# Altium schematic sheet Sheet3.SchDoc
size A
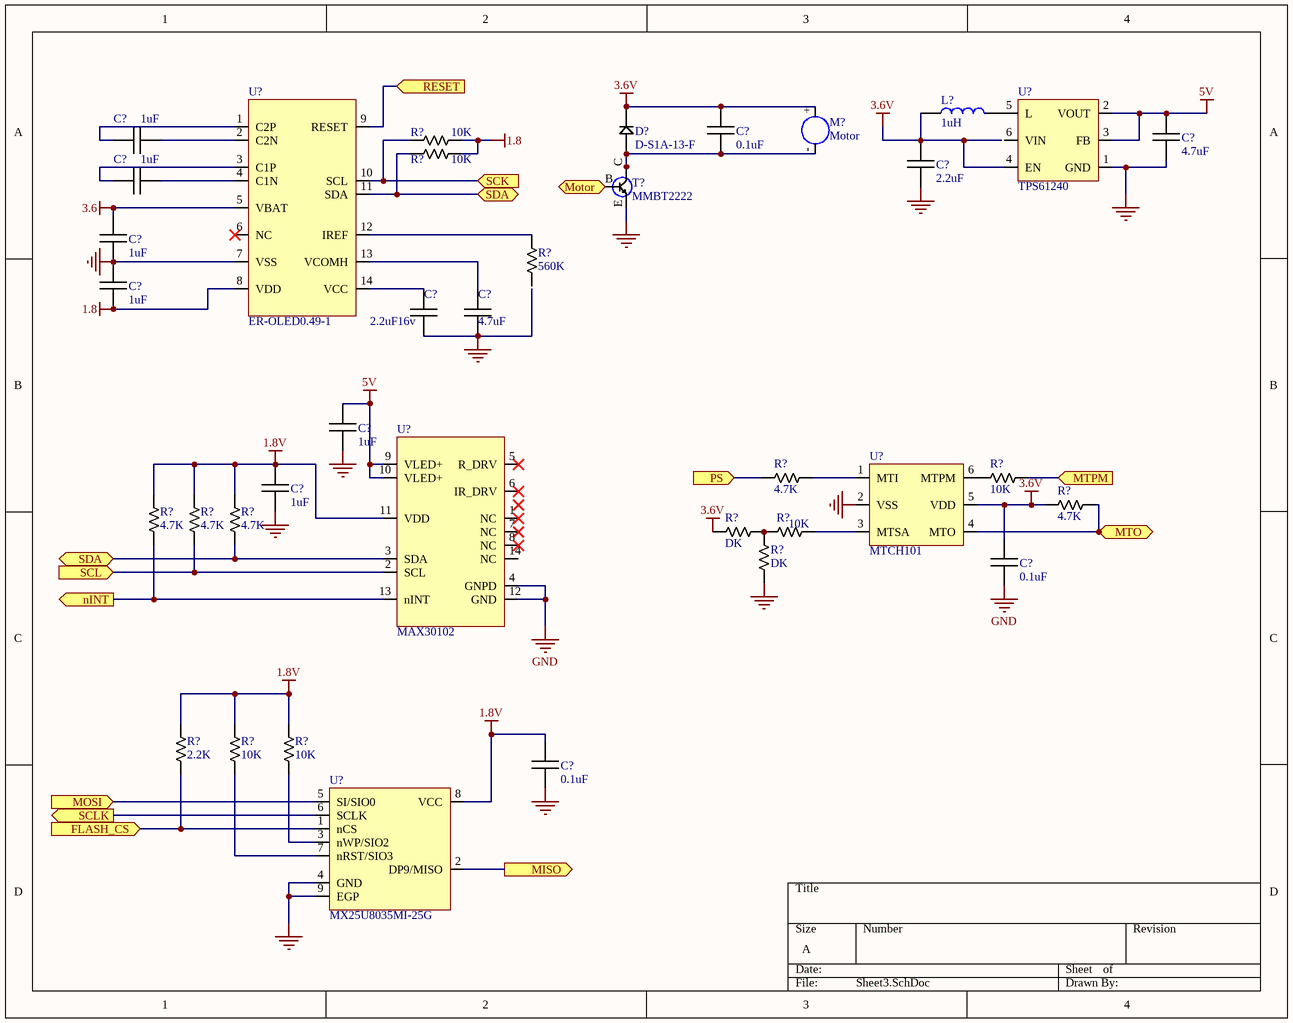
[diagram p0: Sheet3.SchDoc]

## Parts
(Parts that share a designator on the sheet are numbered #1, #2 ... from top to bottom, then left to right.)
C?#1  0.1uF
C?#2  4.7uF
C?#3  1uF
C?#4  2.2uF
C?#5  1uF
C?#6  1uF
C?#7  1uF
C?#8  2.2uF16v
C?#9  4.7uF
C?#10  1uF
C?#11  1uF
C?#12  0.1uF
C?#13  0.1uF
D?  D-S1A-13-F
L?  1uH
M?  Motor
R?#1  10K  [R0603]
R?#2  10K  [R0603]
R?#3  560K  [R0603]
R?#4  4.7K  [R0603]
R?#5  10K  [R0603]
R?#6  4.7K  [R0603]
R?#7  4.7K  [R0603]
R?#8  4.7K  [R0603]
R?#9  4.7K  [R0603]
R?#10  DK  [R0603]
R?#11  10K  [R0603]
R?#12  DK  [R0603]
R?#13  2.2K
R?#14  10K  [R0603]
R?#15  10K  [R0603]
T?  MMBT2222
U?#1  TPS61240
U?#2  ER-OLED0.49-1
U?#3  MTCH101
U?#4  MAX30102
U?#5  MX25U8035MI-25G

## Ports
FLASH_CS (in), MISO (out), MOSI (in), Motor (in), MTO (out), MTPM (in), nINT (out), PS (in), RESET (in), SCK (in), SCL (in), SCLK (out), SDA (bidir)

## Nets
1.8: C?#7.2 R?#1.1 R?#2.1 U?#2.8(VDD)
1.8V: C?#11.2 C?#13.2 R?#7.2 R?#8.2 R?#9.2 R?#13.2 R?#14.2 R?#15.2 U?#4.11(VDD) U?#5.8(VCC)
3.6: C?#6.2 U?#2.5(VBAT)
3.6V: C?#1.2 C?#4.2 C?#12.2 D?.1(-) L?.1 M?.+ R?#6.2 R?#10.1 U?#1.4(EN) U?#3.5(VDD)
5V: C?#2.2 C?#10.2 U?#1.2(VOUT) U?#1.3(FB) U?#4.9(VLED+) U?#4.10(VLED+)
GND: C?#2.1 C?#4.1 C?#6.1 C?#7.1 C?#8.1 C?#9.1 C?#10.1 C?#11.1 C?#12.1 C?#13.1 R?#12.1 T?.E U?#1.1(GND) U?#2.7(VSS) U?#3.2(VSS) U?#4.4(GNPD) U?#4.12(GND) U?#5.4(GND) U?#5.9(EGP)
FLASH_CS: R?#13.1 U?#5.1(nCS) ; port FLASH_CS
MISO: U?#5.2(DP9/MISO) ; port MISO
MOSI: U?#5.5(SI/SIO0) ; port MOSI
Motor: T?.B ; port Motor
MTO: R?#6.1 U?#3.4(MTO) ; port MTO
MTPM: R?#5.2 ; port MTPM
nINT: R?#7.1 U?#4.13(nINT) ; port nINT
PS: R?#4.1 ; port PS
RESET: U?#2.9(RESET) ; port RESET
SCK: R?#1.2 U?#2.10(SCL) ; port SCK
SCL: R?#8.1 U?#4.2(SCL) ; port SCL
SCLK: U?#5.6(SCLK) ; port SCLK
SDA: R?#2.2 R?#9.1 U?#2.11(SDA) U?#4.3(SDA) ; port SDA
NetC?#1_1: C?#1.1 D?.2(+) M?.- T?.C
NetC?#3_1: C?#3.1 U?#2.2(C2N)
NetC?#3_2: C?#3.2 U?#2.1(C2P)
NetC?#5_1: C?#5.1 U?#2.4(C1N)
NetC?#5_2: C?#5.2 U?#2.3(C1P)
NetC?#8_2: C?#8.2 U?#2.14(VCC)
NetC?#9_2: C?#9.2 U?#2.13(VCOMH)
NetL?_2: L?.2 U?#1.5(L)
NetR?#3_2: R?#3.2 U?#2.12(IREF)
NetR?#4_2: R?#4.2 U?#3.1(MTI)
NetR?#5_1: R?#5.1 U?#3.6(MTPM)
NetR?#10_2: R?#10.2 R?#11.1 R?#12.2
NetR?#11_2: R?#11.2 U?#3.3(MTSA)
NetR?#14_1: R?#14.1 U?#5.7(nRST/SIO3)
NetR?#15_1: R?#15.1 U?#5.3(nWP/SIO2)

Not connected (* = marked no-connect by the designer): R?#3 1; U?#1 6(VIN); U?#2 6(NC)*; U?#4 1(NC)* 5(R_DRV)* 6(IR_DRV)* 7(NC)* 8(NC)* 14(NC)

## Library data of the parts
C?#1 C?#12 C?#13 = C0.1uF_0402: SMD_CAPACITOR; Voltage - Rated: 6.3V; Tolerance: ±10%; Packet: 0402; Digi-Key Part Number: 490-6319-1-ND; Capacitance: 0.1uF
C?#2 = C4.7uF_0402: SMD_CAPACITOR; Voltage - Rated: 6.3V; Tolerance: ±20%; Packet: 0402; Digi-Key Part Number: 587-2787-1-ND; Capacitance: 4.7uF
C?#3 C?#5-C?#7 C?#10 C?#11 = C1uF_0402: SMD_CAPACITOR; Voltage - Rated: 10V; Tolerance: ±10%; Packet: 0402; Digi-Key Part Number: 490-3890-1-ND; Capacitance: 1uF
C?#4 = C2.2uF_0402: SMD_CAPACITOR; Voltage - Rated: 6.3V; Tolerance: ±20%; Packet: 0402; Digi-Key Part Number: 587-1453-1-ND; Capacitance: 2.2uF
C?#8 = C2.2uF_0805: SMD_CAPACITOR; Voltage - Rated: 16V; Tolerance: ±10%; Packet: 0805; Digi-Key Part Number: 490-3906-1-ND; Capacitance: 2.2uF16v
C?#9 = C4.7uF_0805: SMD_CAPACITOR; Voltage - Rated: 16V; Tolerance: ±10%; Packet: 0805; Digi-Key Part Number: 445-1385-1-ND; Capacitance: 4.7uF
D? = D-S1A-13-F: ="Description"; Description: DIODE GEN PURP 50V 1A SMA; Package: DO-214AC, SMA
L? = L1uH_0603: SMD_Inductor; Digi-Key Part Number: 490-15634-1-ND; Inductance: 1uH; Package: 0603
M? = Motor: vibrator coin 7mm; Digi-Key Part Number: 1670-1000-ND
R?#1 R?#2 R?#5 R?#11 R?#14 R?#15 = R10K_0201: SMD_RESISTOR; Packet: 0201; Tolerance: ±5%; Power: 1/20W; Digi-Key Part Number: 311-10KNCT-ND; Value: 10K
R?#3 = R560K_0402: SMD_RESISTOR; Packet: 0402; Tolerance: ±5%; Power: 1/16W; Digi-Key Part Number: 311-560KJRCT-ND; Value: 560K
R?#4 R?#6-R?#9 = R4.7K_0402: SMD_RESISTOR; Packet: 0402; Tolerance: ±1%; Power: 1/16W; Digi-Key Part Number: 311-4.7KLRCT-ND; Value: 4.7K
R?#10 R?#12 = RDK_0402: SMD_RESISTOR; Packet: 0402; Value: DK
R?#13 = R2.2K_0402: SMD_RESISTOR; Packet: 0402; Tolerance: ±1%; Power: 1/16W; Digi-Key Part Number: 311-2.20KLRCT-ND; Value: 2.2K
T? = MMBT2222: SMD_Transistor; Digi-Key Part Number: MMBT2222ALT1GOSCT-ND
U?#1 = TPS61240: IC REG BOOST 5V 0.5A SYNC 6SON; Digi-Key Part Number: 296-39437-1-ND
U?#2 = ER-OLED0.49-1: OLED0.49; Website: http://www.buydisplay.com/default/low-power-smallest-blue-i2c-0-49-inch-64x32-oled-module-display-ssd1306
U?#3 = MTCH101: IC PROXIMITY DETECTOR SOT23-6; Digi-Key Part Number: MTCH101-I/OT-ND
U?#4 = MAX30102: Heart rate; Digi-Key Part Number: MAX30102EFD+-ND
U?#5 = MX25U8035MI-25G: IC FLASH 8MBIT 40MHZ 8SOP; Digi-Key Part Number: 1092-1119-ND